# EAGLE design db19f (EAGLE 6.6.0)
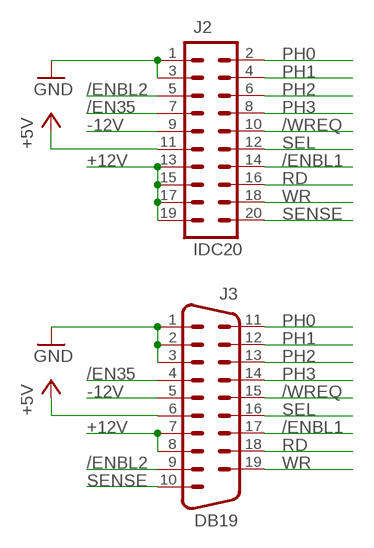
[diagram p0: schematic, sheet 1]

## Parts
J2  IDC20  [IDC20]
J3  DB19  DB19F  [DB19F-EDGE]

## Nets
+5V: J2.11 J3.6
+12V: J2.13 J2.15 J2.17 J2.19 J3.7 J3.8
-12V: J2.9 J3.5
/EN35: J2.7 J3.4
/ENBL1: J2.14 J3.17
/ENBL2: J2.5 J3.9
/WREQ: J2.10 J3.15
GND: J2.1 J2.3 J3.1 J3.2 J3.3
PH0: J2.2 J3.11
PH1: J2.4 J3.12
PH2: J2.6 J3.13
PH3: J2.8 J3.14
RD: J2.16 J3.18
SEL: J2.12 J3.16
SENSE: J2.20 J3.10
WR: J2.18 J3.19

## Library data of the parts
J2 = big-mess-o-wires:IDC20
J3 = big-mess-o-wires:DB19F

## Board
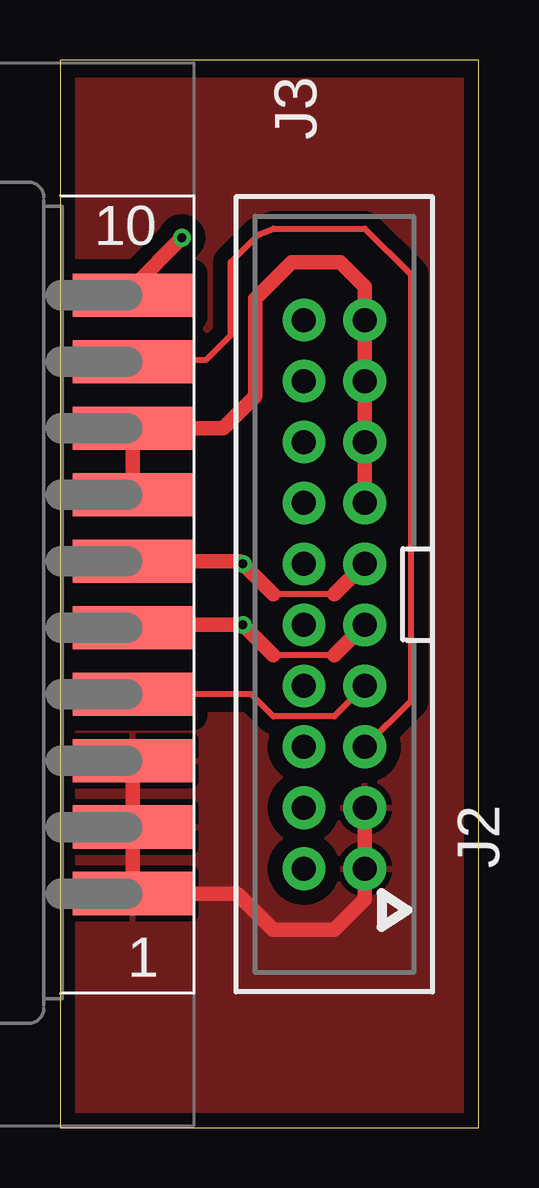
[diagram p1: board, top side]
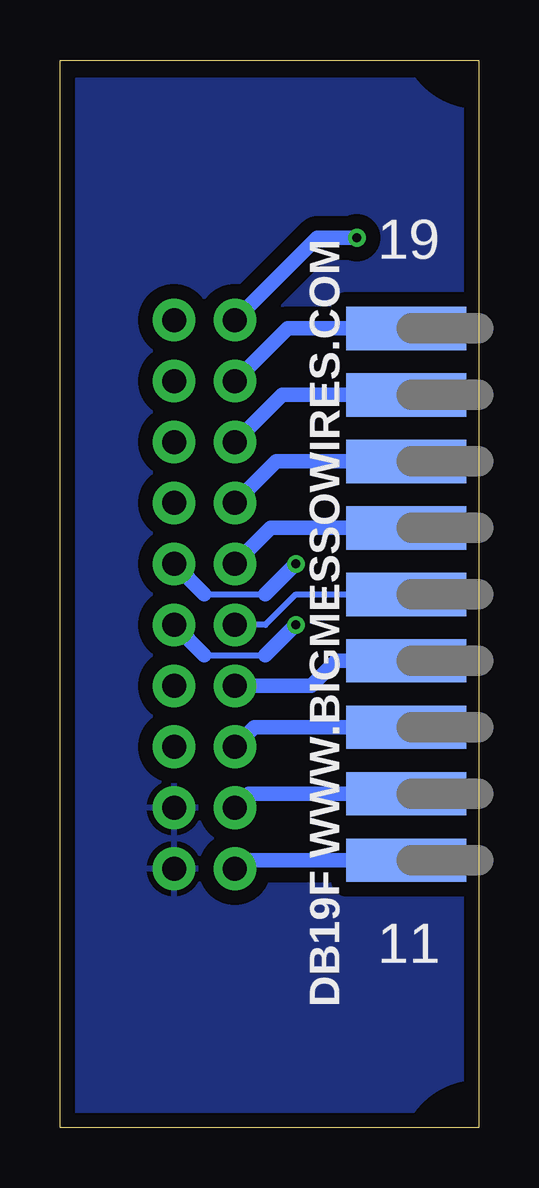
[diagram p2: board, bottom side, seen from below]

Size 17.45 x 44.49 mm. Coordinates in mm from the lower left corner, seen from the top.
Outline: 0,0 17.45,0 17.45,44.49 0,44.49 0,0
Copper layers (1*16): Top 0.0356mm / dielectric 1.5011mm / Bottom 0.0356mm
Design rules "oshpark-2layer *": minimum track width 6mil, minimum drill 13mil, track to track 6mil, track to pad 6mil, pad to pad 6mil, via to via 6mil, smd to smd 6mil, copper to edge 15mil, drill to drill 6mil, minimum pad ring 7mil, minimum via ring 7mil, stop-mask expansion 2.5mil, vias tented up to drill 15mil, thermal gap 10mil

### Footprints (pad centres in the part's own frame; a part is rotated, then mirrored left to right if it is on the bottom)
IDC20 = drill 1 pad 1.778: 1 -11.43,-1.27; 2 -11.43,1.27; 3 -8.89,-1.27; 4 -8.89,1.27; 5 -6.35,-1.27; 6 -6.35,1.27; 7 -3.81,-1.27; 8 -3.81,1.27; 9 -1.27,-1.27; 10 -1.27,1.27; 11 1.27,-1.27; 12 1.27,1.27; 13 3.81,-1.27; 14 3.81,1.27; 15 6.35,-1.27; 16 6.35,1.27; 17 8.89,-1.27; 18 8.89,1.27; 19 11.43,-1.27; 20 11.43,1.27
DB19F-EDGE = smd 1.8 x 5: 1 12.465,5.54; 2 9.695,5.54; 3 6.925,5.54; 4 4.155,5.54; 5 1.385,5.54; 6 -1.385,5.54; 7 -4.155,5.54; 8 -6.925,5.54; 9 -9.695,5.54; 10 -12.465,5.54 | smd 1.8 x 5 bottom: 11 11.08,5.54; 12 8.31,5.54; 13 5.54,5.54; 14 2.77,5.54; 15 0,5.54; 16 -2.77,5.54; 17 -5.54,5.54; 18 -8.31,5.54; 19 -11.08,5.54

### Placement (x,y rotation side)
J2  11.43,22.23 90 top
J3  -2.51,22.23 270 top

### Tracks (layer width: path | path; a pad name or v marks a point on that pad's centre or on a via)
+5V  (via drill 0.38)
  Top 0.254: 11.43,22.23 8.89,22.23
  Top 0.61: J2.11 11.43,22.23 | 8.89,22.23 v7.62,23.5 7.5,23.61 J3.6
  Bottom 0.254: 11.43,22.23 8.89,22.23
  Bottom 0.61: J2.11 11.43,22.23 | 8.89,22.23 v7.62,23.5
+12V
  Top 0.61: J3.7 J3.8 6.8,29.15 8.13,30.48 8.13,34.54 9.65,36.07 11.68,36.07 12.7,35.05 J2.15 | J2.19 J2.17 J2.15 | J2.15 J2.13
-12V  (via drill 0.38)
  Top 0.254: 11.43,19.68 8.89,19.68 | 3.14,20.95 J3.5
  Top 0.61: J2.9 11.43,19.68 | 8.89,19.68 v7.62,20.95 3.14,20.95
  Bottom 0.254: 11.43,19.68 8.89,19.68
  Bottom 0.61: J2.9 11.43,19.68 | 8.89,19.68 v7.62,20.95
/EN35
  Top 0.254: J2.7 11.43,17.14 8.89,17.14 7.96,18.07 J3.4
/ENBL1
  Bottom 0.61: J2.14 8.43,27.77 J3.17
/ENBL2
  Top 0.254: 3.11,32 6.1,32 7.11,33.02 7.11,36.07 8.26,37.21 8.89,37.47 12.7,37.47 14.61,35.56 14.61,17.78 J2.5
  Top 0.61: J3.9 3.11,32
/WREQ
  Bottom 0.254: J3.15 7.62,22.23 8.89,20.95 J2.10
GND
  Top 0.61: J3.3 J3.2 J3.1 7.38,9.76 8.89,8.26 11.43,8.26 12.7,9.53 J2.3 J2.1
  pour Top (isolate 0.61): 0.51,0.51 16.76,0.51 16.76,43.69 0.51,43.69
  pour Bottom (isolate 0.61): 0.51,0.51 16.76,0.51 16.76,43.69 0.51,43.69
PH0
  Bottom 0.61: J2.2 9.81,11.14 J3.11
PH1
  Bottom 0.61: J2.4 9.58,13.91 J3.12
PH2
  Bottom 0.61: J2.6 9.35,16.68 J3.13
PH3
  Bottom 0.61: J2.8 6.99,18.41 5.95,19.45 J3.14
RD
  Bottom 0.61: J2.16 8.2,30.54 J3.18
SEL
  Bottom 0.61: J2.12 8.66,25 J3.16
SENSE  (via drill 0.38)
  Top 0.61: v5.08,37.08 3.02,35.03 J3.10
  Bottom 0.61: J2.20 6.73,37.08 v5.08,37.08
WR
  Bottom 0.61: J2.18 7.97,33.3 J3.19

### Text on the board
bPlace: DB19F WWW.BIGMESSOWIRES.COM